# Altium schematic sheet 11 FREELINK.SchDoc
size 817 x 513 mm
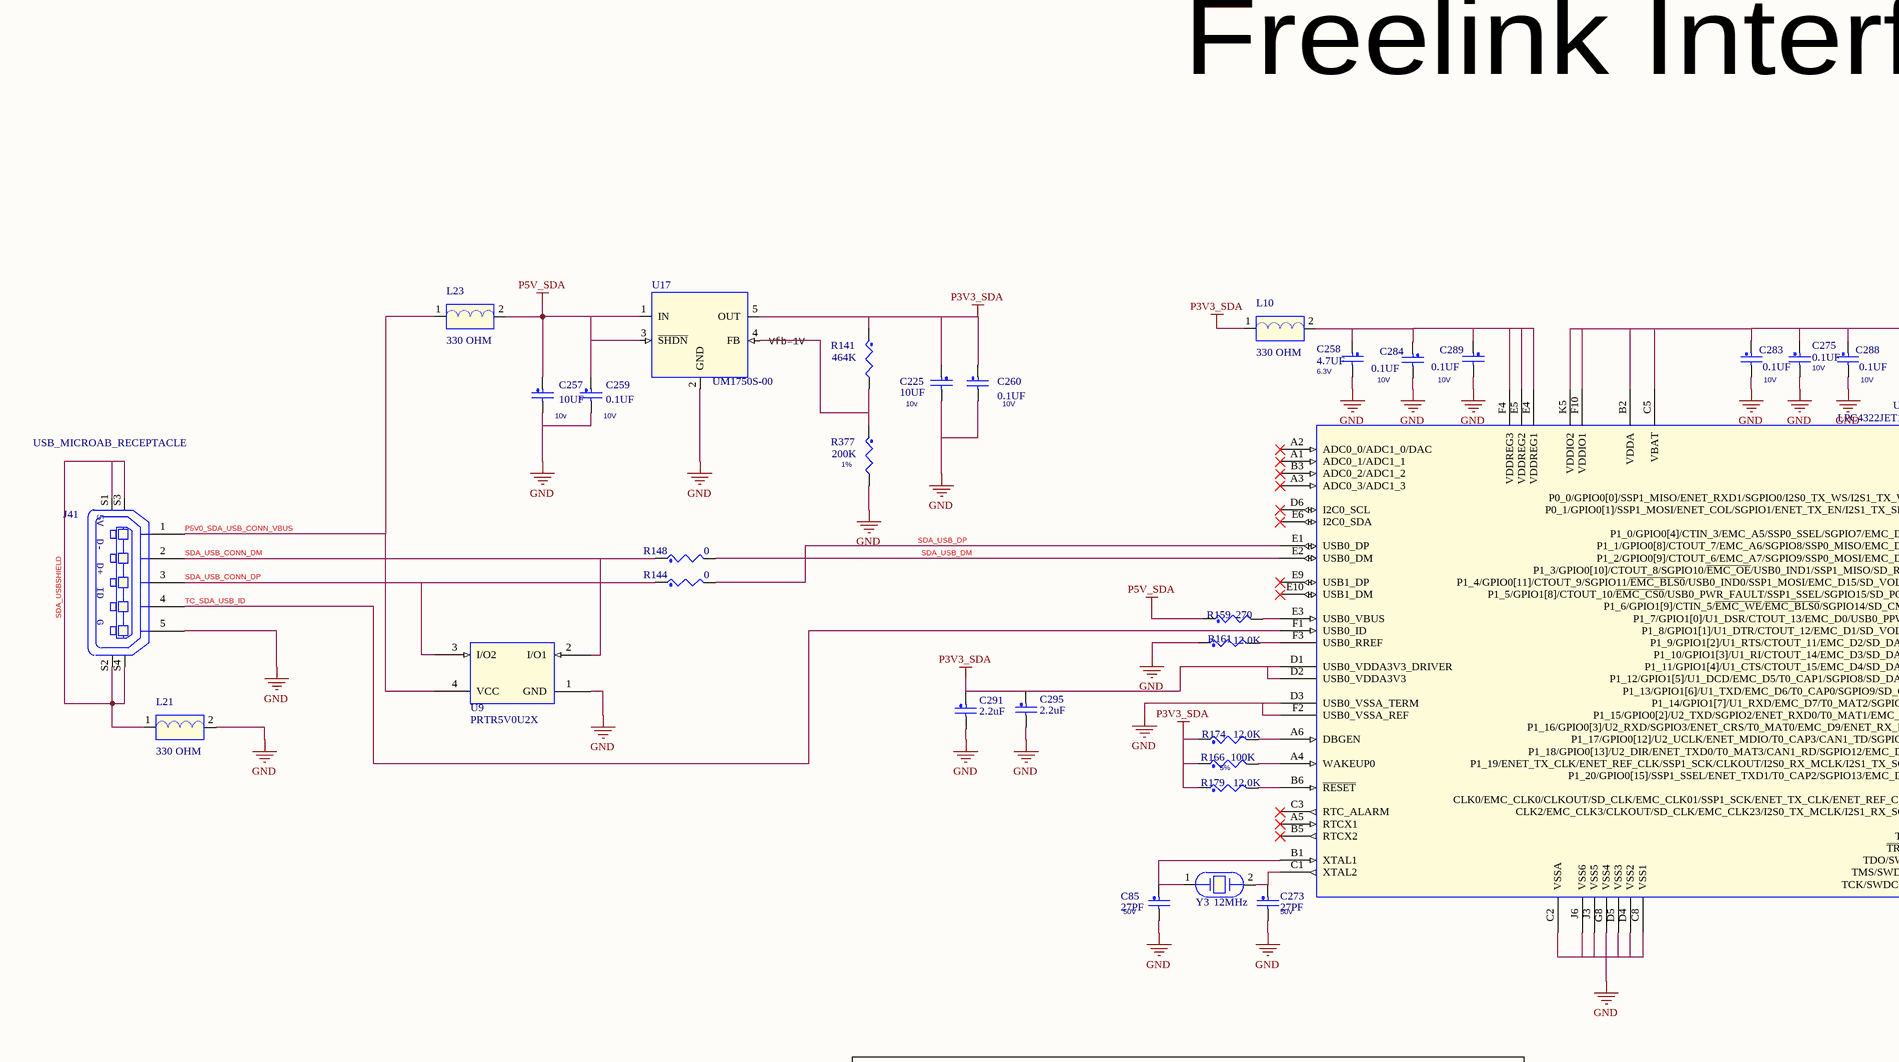
[diagram p0: 11 FREELINK.SchDoc, top left]
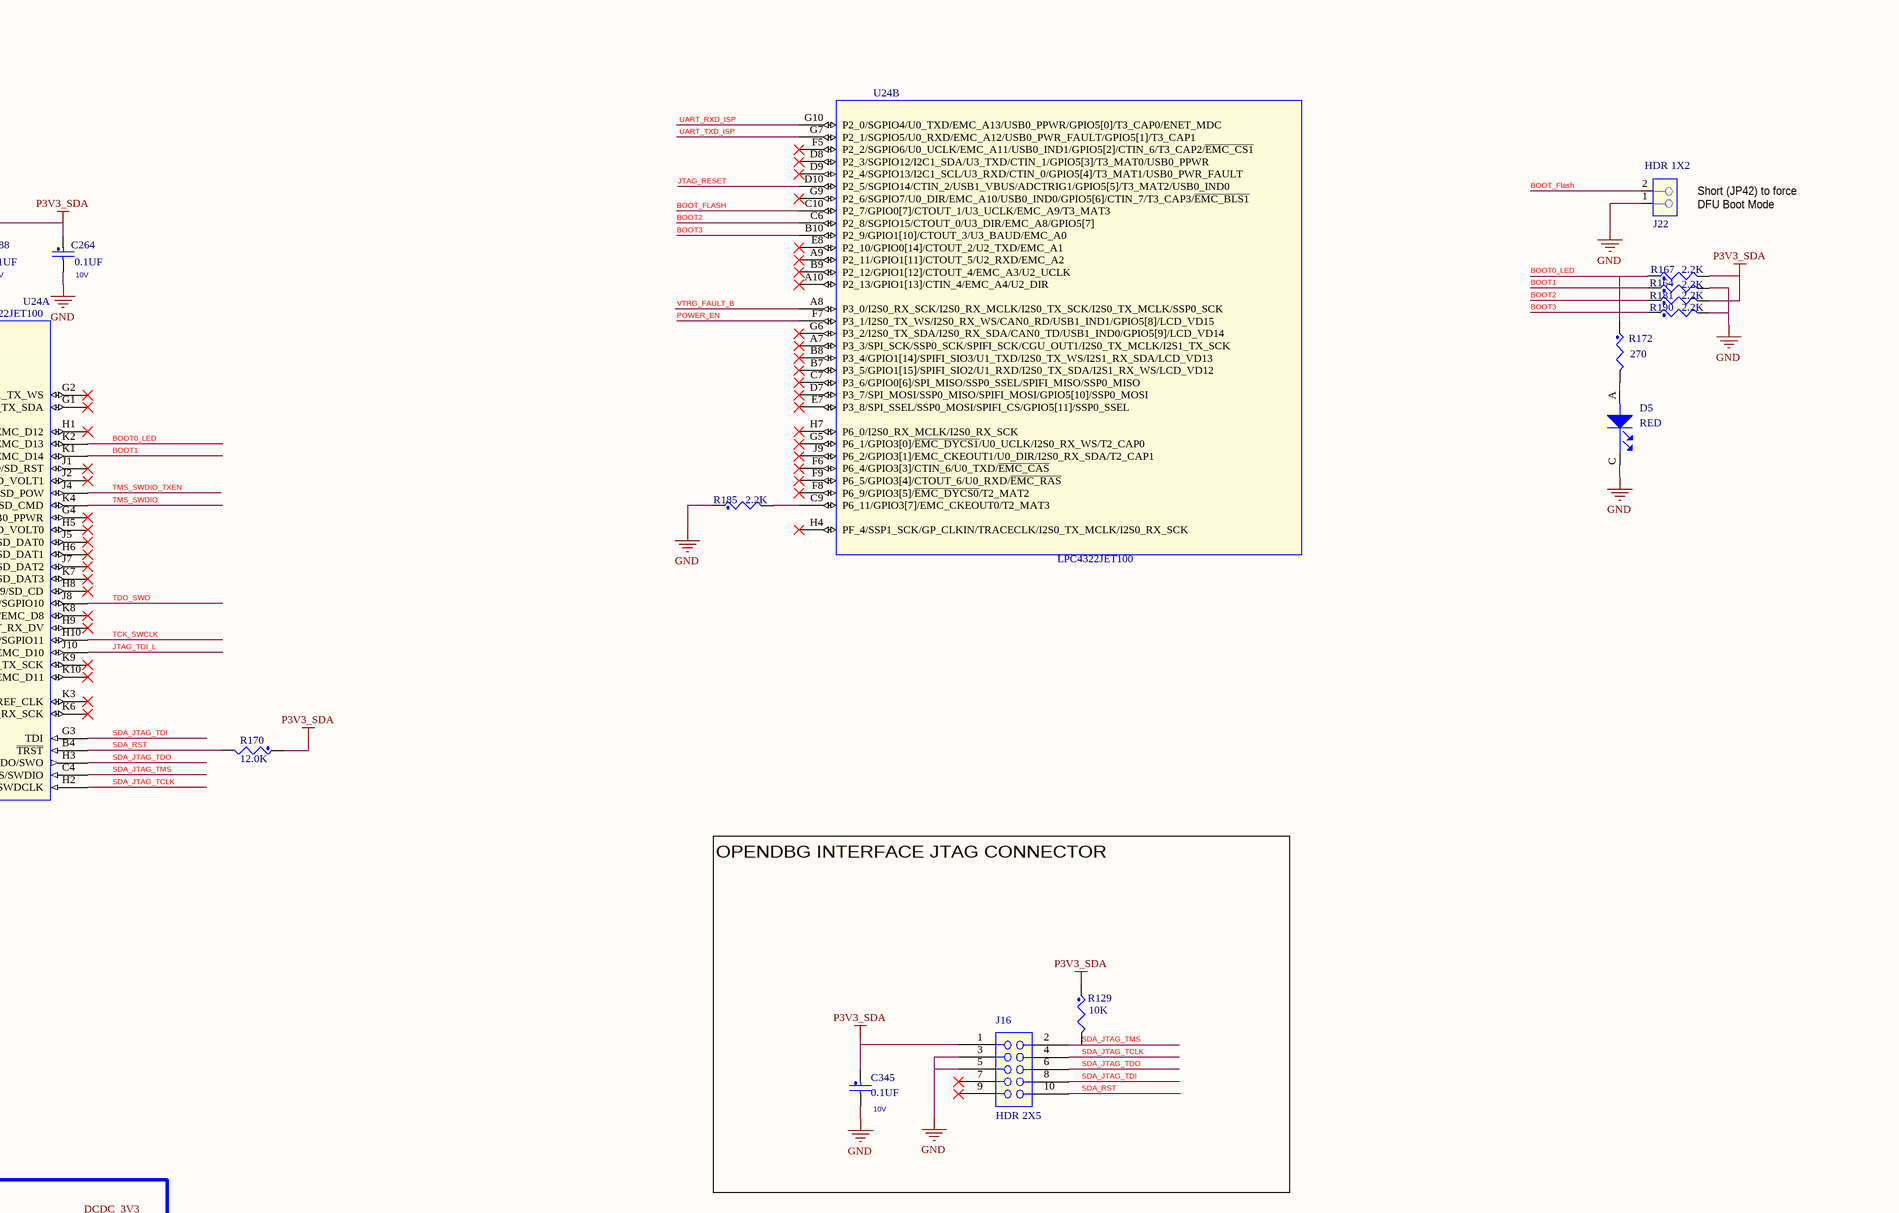
[diagram p1: 11 FREELINK.SchDoc, top right]
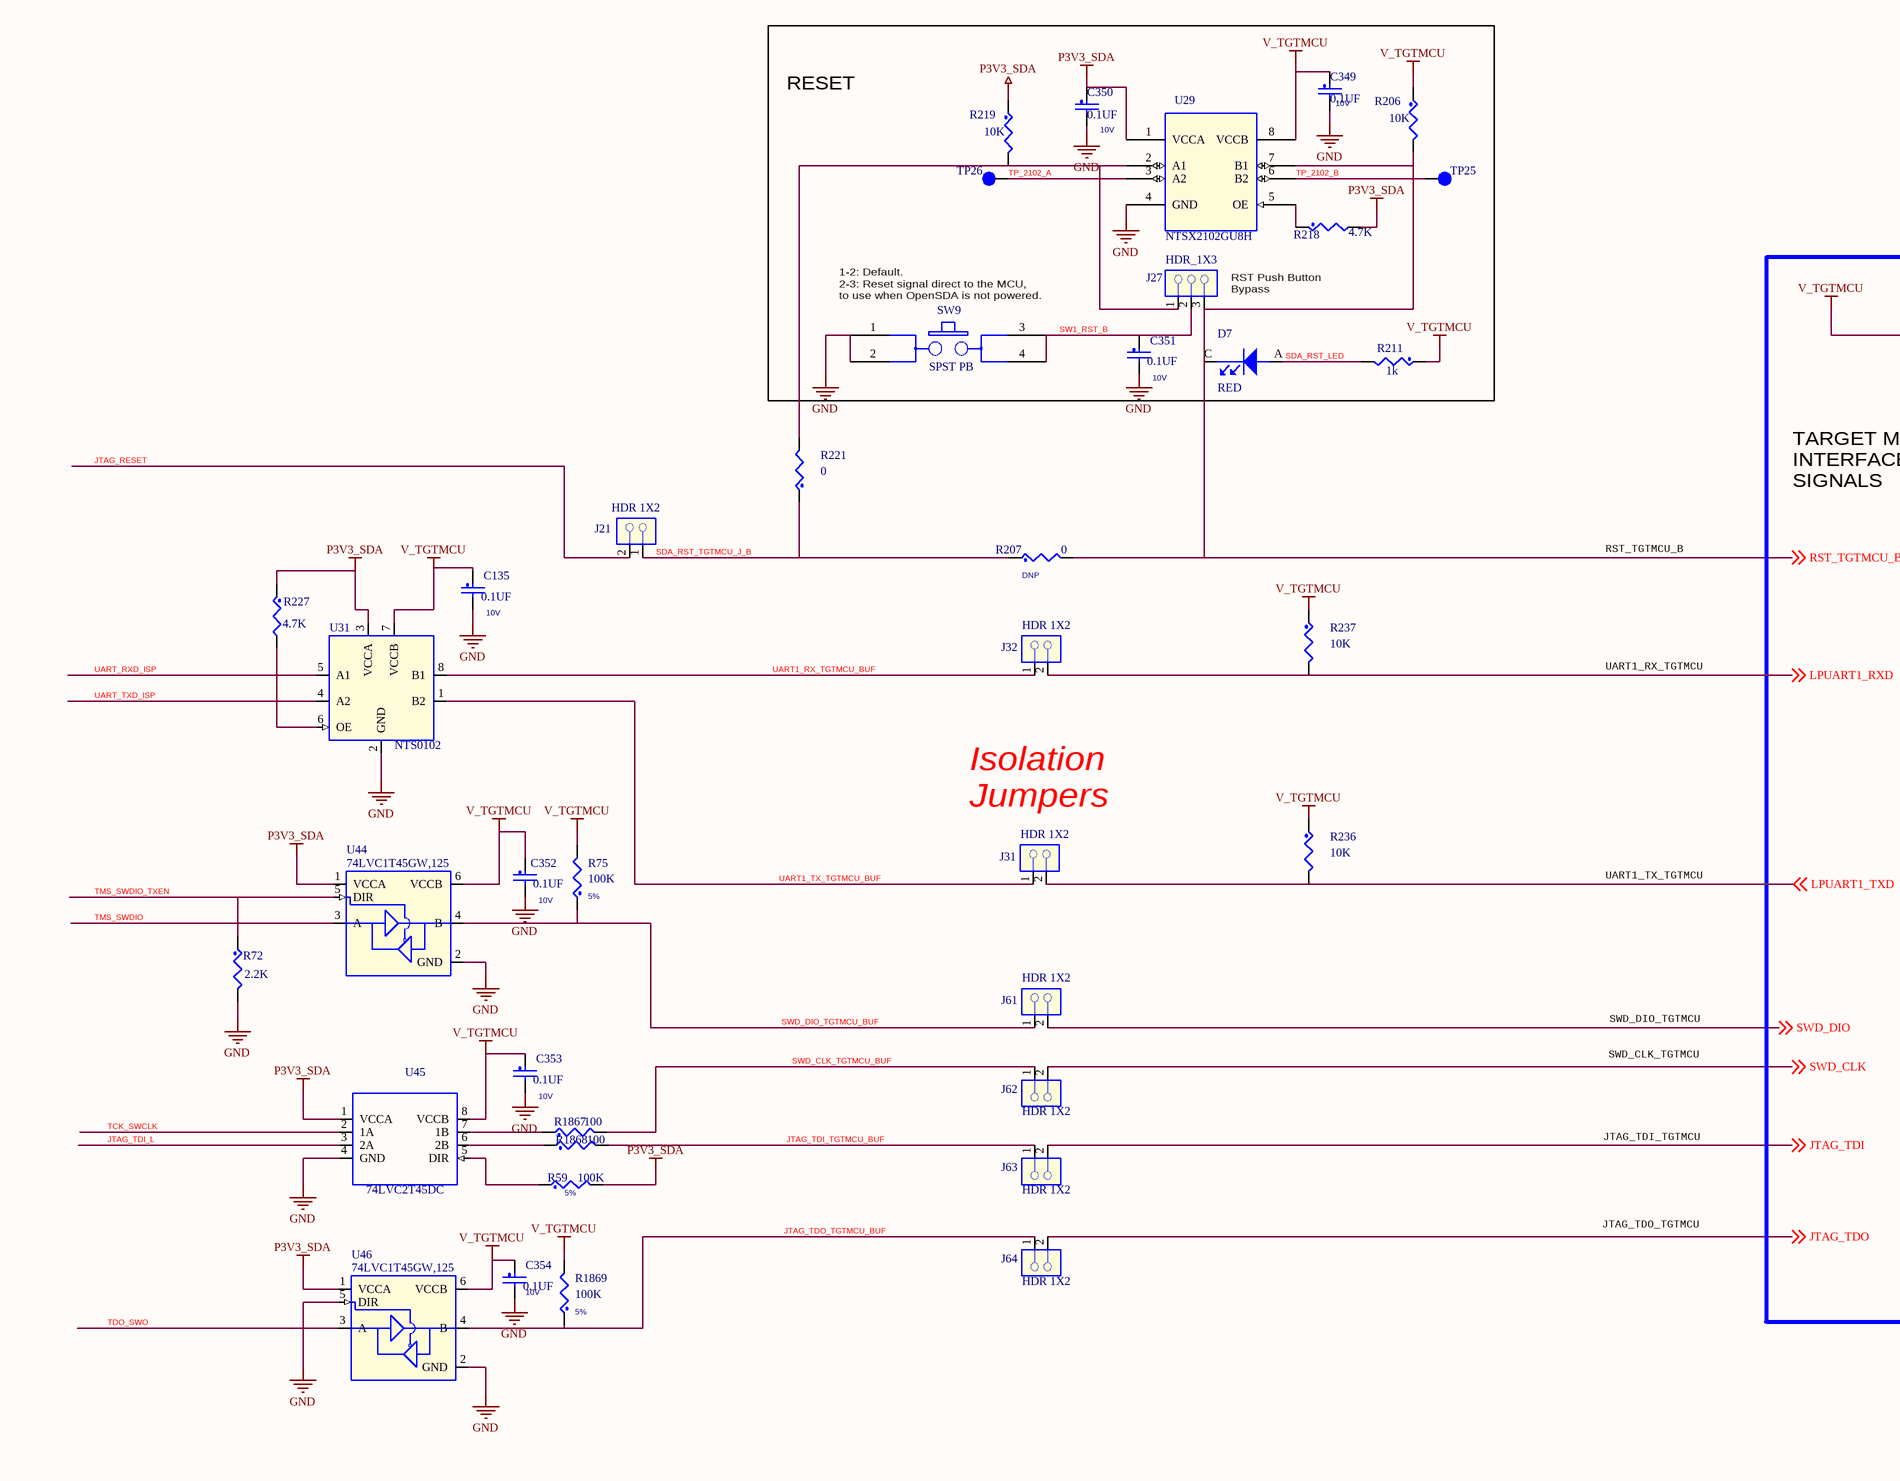
[diagram p2: 11 FREELINK.SchDoc, bottom left]
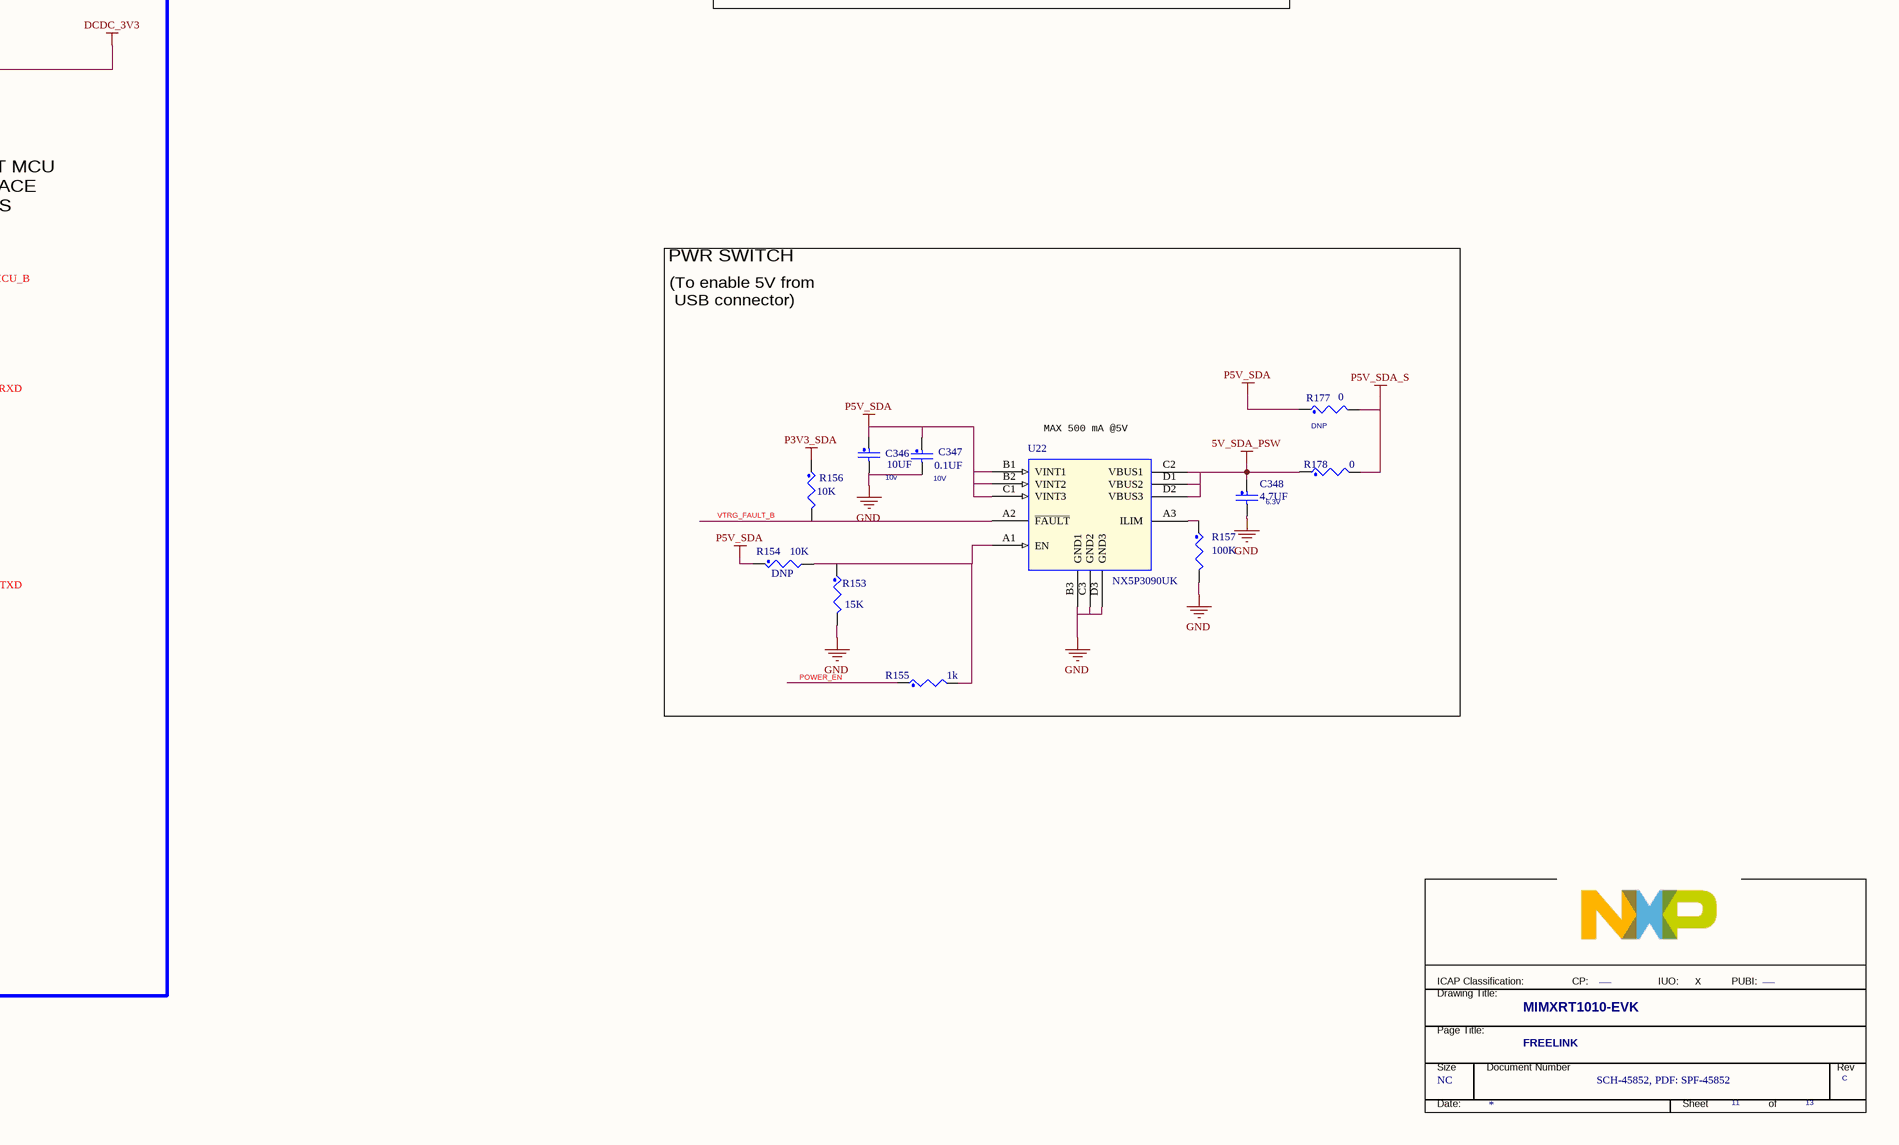
[diagram p3: 11 FREELINK.SchDoc, bottom right]

## Parts
*  PUBI: ___  Doc: SCH-45852, PDF: SPF-45852  RevCode: C  Title: MIMXRT1010-EVK  Page Size: NC  Page Number: 11  Page Count: 13  PageTitle: FREELINK  (hidden comment: TitleBlock_FS)  (graphical)
C85  27PF  VOLTAGE: 50V  [0402_CC]
C135  0.1UF  VOLTAGE: 10V  [0402_CC]
C225  10UF  VOLTAGE: 10v  [CC0603_OV]
C257  10UF  VOLTAGE: 10v  [CC0603_OV]
C258  4.7UF  voltage rating: 6.3V  [0402_CC]
C259  0.1UF  VOLTAGE: 10V  [0402_CC]
C260  0.1UF  VOLTAGE: 10V  [0402_CC]
C264  0.1UF  VOLTAGE: 10V  [0402_CC]
C273  27PF  VOLTAGE: 50V  [0402_CC]
C275  0.1UF  VOLTAGE: 10V  [0402_CC]
C283  0.1UF  VOLTAGE: 10V  [0402_CC]
C284  0.1UF  VOLTAGE: 10V  [0402_CC]
C288  0.1UF  VOLTAGE: 10V  [0402_CC]
C289  0.1UF  VOLTAGE: 10V  [0402_CC]
C291  2.2uF  [0402_CC]
C295  2.2uF  [0402_CC]
C345  0.1UF  VOLTAGE: 10V  [0402_CC]
C346  10UF  VOLTAGE: 10v  [CC0603_OV]
C347  0.1UF  VOLTAGE: 10V  [0402_CC]
C348  4.7UF  VOLTAGE: 6.3V  [0402_CC]
C349  0.1UF  VOLTAGE: 10V  [0402_CC]
C350  0.1UF  VOLTAGE: 10V  [0402_CC]
C351  0.1UF  VOLTAGE: 10V  [0402_CC]
C352  0.1UF  VOLTAGE: 10V  [0402_CC]
C353  0.1UF  VOLTAGE: 10V  [0402_CC]
C354  0.1UF  VOLTAGE: 10V  [0402_CC]
D5  RED  [LED_0603]
D7  RED  [LED_0603]
J16  HDR 2X5  [hdr205_50_th]
J21  HDR 1X2  [HDR102]
J22  HDR 1X2  [HDR102]
J27  HDR_1X3  [HDR103]
J31  HDR 1X2  [HDR102]
J32  HDR 1X2  [HDR102]
J41  USB_MICROAB_RECEPTACLE  [con_usb5_microab_0p65_sm]
J61  HDR 1X2  [HDR102]
J62  HDR 1X2  [HDR102]
J63  HDR 1X2  [HDR102]
J64  HDR 1X2  [HDR102]
L10  330 OHM  [ind_1608]
L21  330 OHM  [ind_1608]
L23  330 OHM  [ind_1608]
R59  100K  Tolerance: 5%  [0402_CC]
R72  2.2K  [0402_CC]
R75  100K  Tolerance: 5%  [0402_CC]
R129  10K  [0402_CC]
R141  464K  [0402_CC]
R144  0  [0402_CC]
R148  0  [0402_CC]
R153  15K  [0402_CC]
R154  10K  ASSY_OPT: DNP  [0402_CC]
R155  1k  [0402_CC]
R156  10K  [0402_CC]
R157  100K  [0402_CC]
R159  270  [0402_CC]
R161  12.0K  [0402_CC]
R164  2.2K  [0402_CC]
R166  100K  Tolerance: 5%  [0402_CC]
R167  2.2K  [0402_CC]
R170  12.0K  [0402_CC]
R172  270  [0402_CC]
R174  12.0K  [0402_CC]
R177  0  ASSY_OPT: DNP  [0402_CC]
R178  0  [0402_CC]
R179  12.0K  [0402_CC]
R181  2.2K  [0402_CC]
R185  2.2K  [0402_CC]
R190  2.2K  [0402_CC]
R206  10K  [0402_CC]
R207  0  ASSY_OPT: DNP  [0402_CC]
R211  1k  [0402_CC]
R218  4.7K  [0402_CC]
R219  10K  [0402_CC]
R221  0  [0402_CC]
R227  4.7K  [0402_CC]
R236  10K  [0402_CC]
R237  10K  [0402_CC]
R377  200K  Tolerance: 1%  [0402_CC]
R1867  100  [0402_CC]
R1868  100  [0402_CC]
R1869  100K  Tolerance: 5%  [0402_CC]
SW9  SPST PB  [SW4_PB_ESW_SM_P177]
TP25  TPAD_030  [TPAD_030]  (value not drawn)
TP26  TPAD_030  [TPAD_030]  (value not drawn)
U9  PRTR5V0U2X  [SOT143B]
U17  UM1750S-00  [sot23-5_a]
U22  NX5P3090UK  [wlcsp12_0p4_1p38x1p68mm_smdp]
U24  LPC4322JET100  [fbga100_0p8_9x9]  (parts A,B of 2)
U29  NTSX2102GU8H  [SO-8]
U31  NTS0102  [tssop8_a]
U44  74LVC1T45GW,125  [SOT-363_0P65_SMT]
U45  74LVC2T45DC  [SSOP8_DCU]
U46  74LVC1T45GW,125  [SOT-363_0P65_SMT]
Y3  12MHz  [xtl2_11p6x4p85_sm]

## Blocks framed on the sheet
OPENDBG INTERFACE JTAG CONNECTOR: C345 J16 R129
RESET: C349-C351 D7 J27 R206 R211 R218 R219 SW9 TP25 TP26 U29
PWR SWITCH: C346-C348 R153-R157 R177 R178 U22

## Nets
5V_SDA_PSW: C348.1 R178.1 U22.C2(VBUS1) U22.D1(VBUS2) U22.D2(VBUS3)
DCDC_3V3: C135.1 C349.1 C352.1 C353.1 C354.1 R75.2 R206.1 R211.1 R236.1 R237.1 R1869.2 U29.8(VCCB) U31.7(VCCB) U44.6(VCCB) U45.8(VCCB) U46.6(VCCB)  [also labelled V_TGTMCU]
GND: C85.2 C135.2 C225.2 C257.2 C258.2 C259.2 C260.2 C264.2 C273.2 C275.2 C283.2 C284.2 C288.2 C289.2 C291.2 C295.2 C345.2 C346.2 C347.2 C348.2 C349.2 C350.2 C351.2 C352.2 C353.2 C354.2 D5.C(CATHODE) J16.3(A2) J16.5(A3) J22.1 J41.5(P5) L21.2 R72.2 R153.2 R157.2 R161.1 R164.2 R185.1 R190.2 R377.2 SW9.1(A1) SW9.2(A2) U9.1(GND) U17.2(GND) U22.B3(GND1) U22.C3(GND2) U22.D3(GND3) U24.C2(VSSA) U24.C8(VSS1) U24.D3(USB0_VSSA_TERM) U24.D4(VSS2) U24.D5(VSS3) U24.F2(USB0_VSSA_REF) U24.G8(VSS4) U24.J3(VSS5) U24.J6(VSS6) U29.4(GND) U31.2(GND) U44.2(GND) U45.4(GND) U46.2(GND) U46.5(DIR)
P3V3_SDA: C225.1 C260.1 C264.1 C275.1 C283.1 C288.1 C291.1 C295.1 C345.1 C350.1 J16.1(A1) L10.1 R59.2 R129.1 R141.1 R156.1 R166.1 R167.2 R170.1 R174.1 R179.1 R181.2 R218.2 R219.1 R227.1 U17.5(OUT) U24.B2(VDDA) U24.C5(VBAT) U24.D1(USB0_VDDA3V3_DRIVER) U24.D2(USB0_VDDA3V3) U24.F10(VDDIO1) U24.K5(VDDIO2) U29.1(VCCA) U31.3(VCCA) U44.1(VCCA) U45.1(VCCA) U46.1(VCCA)
P5V_SDA: C257.1 C259.1 C346.1 C347.1 L23.2 R154.1 R159.1 R177.1 U17.1(IN) U17.3(~{SHDN}) U22.B1(VINT1) U22.B2(VINT2) U22.C1(VINT3)
P5V_SDA_S: R177.2 R178.2
BOOT0_LED: R167.1 R172.1 U24.K2(P1_1/GPIO0[8]/CTOUT_7/EMC_A6/SGPIO8/SSP0_MISO/EMC_D13)
BOOT1: R164.1 U24.K1(P1_2/GPIO0[9]/CTOUT_6/EMC_A7/SGPIO9/SSP0_MOSI/EMC_D14)
BOOT2: R181.1 U24.C6(P2_8/SGPIO15/CTOUT_0/U3_DIR/EMC_A8/GPIO5[7])
BOOT3: R190.1 U24.B10(P2_9/GPIO1[10]/CTOUT_3/U3_BAUD/EMC_A0)
BOOT_Flash: J22.2 U24.C10(P2_7/GPIO0[7]/CTOUT_1/U3_UCLK/EMC_A9/T3_MAT3)
JTAG_RESET: J21.2 U24.D10(P2_5/SGPIO14/CTIN_2/USB1_VBUS/ADCTRIG1/GPIO5[5]/T3_MAT2/USB0_IND0)
JTAG_TDI: J63.2 ; off-sheet JTAG_TDI
JTAG_TDI_L: U24.J10(P1_18/GPIO0[13]/U2_DIR/ENET_TXD0/T0_MAT3/CAN1_RD/SGPIO12/EMC_D10) U45.3(2A)
JTAG_TDI_TGTMCU_BUF: J63.1 R1868.2
JTAG_TDO: J64.2 ; off-sheet JTAG_TDO
JTAG_TDO_TGTMCU_BUF: J64.1 R1869.1 U46.4(B)
LPUART1_RXD: J32.2 R237.2 ; off-sheet LPUART1_RXD
LPUART1_TXD: J31.2 R236.2 ; off-sheet LPUART1_TXD
P5V0_SDA_USB_CONN_VBUS: J41.1(P1) L23.1 U9.4(VCC)
POWER_EN: R155.1 U24.F7(P3_1/I2S0_TX_WS/I2S0_RX_WS/CAN0_RD/USB1_IND1/GPIO5[8]/LCD_VD15)
RST_TGTMCU_B: D7.C(CATHODE) J27.3 R206.2 R207.2 U29.7(B1) ; off-sheet RST_TGTMCU_B
SDA_JTAG_TCLK: J16.4(B2) U24.H2(TCK/SWDCLK)
SDA_JTAG_TDI: J16.8(B4) U24.G3(TDI)
SDA_JTAG_TDO: J16.6(B3) U24.H3(TDO/SWO)
SDA_JTAG_TMS: J16.2(B1) R129.2 U24.C4(TMS/SWDIO)
SDA_RST: J16.10(B5) R170.2 U24.B4(~{TRST})
SDA_RST_LED: D7.A(ANODE) R211.2
SDA_RST_TGTMCU_J_B: J21.1 R207.1 R221.1
SDA_USB_CONN_DM: J41.2(P2) R148.1 U9.2(I/O1)
SDA_USB_CONN_DP: J41.3(P3) R144.1 U9.3(I/O2)
SDA_USB_DM: R148.2 U24.E2(USB0_DM)
SDA_USB_DP: R144.2 U24.E1(USB0_DP)
SDA_USBSHIELD: J41.S1(SHLD1) J41.S2(SHLD2) J41.S3(SHLD3) J41.S4(SHLD4) L21.1
SW1_RST_B: C351.1 J27.2 SW9.3(B1) SW9.4(B2)
SWD_CLK: J62.2 ; off-sheet SWD_CLK
SWD_CLK_TGTMCU_BUF: J62.1 R1867.2
SWD_DIO: J61.2 ; off-sheet SWD_DIO
SWD_DIO_TGTMCU_BUF: J61.1 R75.1 U44.4(B)
TC_SDA_USB_ID: J41.4(P4) U24.F1(USB0_ID)
TCK_SWCLK: U24.H10(P1_17/GPIO0[12]/U2_UCLK/ENET_MDIO/T0_CAP3/CAN1_TD/SGPIO11) U45.2(1A)
TDO_SWO: U24.J8(P1_14/GPIO1[7]/U1_RXD/EMC_D7/T0_MAT2/SGPIO10) U46.3(A)
TMS_SWDIO: U24.K4(P1_6/GPIO1[9]/CTIN_5/~{EMC_WE}/~{EMC_BLS0}/SGPIO14/SD_CMD) U44.3(A)
TMS_SWDIO_TXEN: R72.1 U24.J4(P1_5/GPIO1[8]/CTOUT_10/~{EMC_CS0}/USB0_PWR_FAULT/SSP1_SSEL/SGPIO15/SD_POW) U44.5(DIR)
TP_2102_A: TP26.1(Pin1) U29.3(A2)
TP_2102_B: TP25.1(Pin1) U29.6(B2)
UART1_RX_TGTMCU_BUF: J32.1 U31.8(B1)
UART1_TX_TGTMCU_BUF: J31.1 U31.1(B2)
UART_RXD_ISP: U24.G10(P2_0/SGPIO4/U0_TXD/EMC_A13/USB0_PPWR/GPIO5[0]/T3_CAP0/ENET_MDC) U31.5(A1)
UART_TXD_ISP: U24.G7(P2_1/SGPIO5/U0_RXD/EMC_A12/USB0_PWR_FAULT/GPIO5[1]/T3_CAP1) U31.4(A2)
VTRG_FAULT_B: R156.2 U22.A2(~{FAULT}) U24.A8(P3_0/I2S0_RX_SCK/I2S0_RX_MCLK/I2S0_TX_SCK/I2S0_TX_MCLK/SSP0_SCK)
NetC85_1: C85.1 U24.B1(XTAL1) Y3.1
NetC258_1: C258.1 C284.1 C289.1 L10.2 U24.E4(VDDREG1) U24.E5(VDDREG2) U24.F4(VDDREG3)
NetC273_1: C273.1 U24.C1(XTAL2) Y3.2
NetD5_A: D5.A(ANODE) R172.2
NetJ27_1: J27.1 R219.2 R221.2 U29.2(A1)
NetR59_1: R59.1 U45.5(DIR)
NetR141_2: R141.2 R377.1 U17.4(FB)
NetR153_1: R153.1 R154.2 R155.2 U22.A1(EN)
NetR157_1: R157.1 U22.A3(ILIM)
NetR159_2: R159.2 U24.E3(USB0_VBUS)
NetR161_2: R161.2 U24.F3(USB0_RREF)
NetR166_2: R166.2 U24.A4(WAKEUP0)
NetR174_2: R174.2 U24.A6(DBGEN)
NetR179_2: R179.2 U24.B6(~{RESET})
NetR185_2: R185.2 U24.C9(P6_11/GPIO3[7]/EMC_CKEOUT0/T2_MAT3)
NetR218_1: R218.1 U29.5(OE)
NetR227_2: R227.2 U31.6(OE)
NetR1867_1: R1867.1 U45.7(1B)
NetR1868_1: R1868.1 U45.6(2B)

Not connected (* = marked no-connect by the designer): J16 7(A4)* 9(A5)*; U24 A1(ADC0_1/ADC1_1)* A2(ADC0_0/ADC1_0/DAC)* A3(ADC0_3/ADC1_3)* A5(RTCX1)* A7(P3_3/SPI_SCK/SSP0_SCK/SPIFI_SCK/CGU_OUT1/I2S0_TX_MCLK/I2S1_TX_SCK)* A9(P2_11/GPIO1[11]/CTOUT_5/U2_RXD/EMC_A2)* A10(P2_13/GPIO1[13]/CTIN_4/EMC_A4/U2_DIR)* B3(ADC0_2/ADC1_2)* B5(RTCX2)* B7(P3_5/GPIO1[15]/SPIFI_SIO2/U1_RXD/I2S0_TX_SDA/I2S1_RX_WS/LCD_VD12)* B8(P3_4/GPIO1[14]/SPIFI_SIO3/U1_TXD/I2S0_TX_WS/I2S1_RX_SDA/LCD_VD13)* B9(P2_12/GPIO1[12]/CTOUT_4/EMC_A3/U2_UCLK)* C3(RTC_ALARM)* C7(P3_6/GPIO0[6]/SPI_MISO/SSP0_SSEL/SPIFI_MISO/SSP0_MISO)* D6(I2C0_SCL)* D7(P3_7/SPI_MOSI/SSP0_MISO/SPIFI_MOSI/GPIO5[10]/SSP0_MOSI)* D8(P2_3/SGPIO12/I2C1_SDA/U3_TXD/CTIN_1/GPIO5[3]/T3_MAT0/USB0_PPWR)* D9(P2_4/SGPIO13/I2C1_SCL/U3_RXD/CTIN_0/GPIO5[4]/T3_MAT1/USB0_PWR_FAULT)* E6(I2C0_SDA)* E7(P3_8/SPI_SSEL/SSP0_MOSI/SPIFI_CS/GPIO5[11]/SSP0_SSEL)* E8(P2_10/GPIO0[14]/CTOUT_2/U2_TXD/EMC_A1)* E9(USB1_DP)* E10(USB1_DM)* F5(P2_2/SGPIO6/U0_UCLK/EMC_A11/USB0_IND1/GPIO5[2]/CTIN_6/T3_CAP2/~{EMC_CS1})* F6(P6_4/GPIO3[3]/CTIN_6/U0_TXD/~{EMC_CAS})* F8(P6_9/GPIO3[5]/~{EMC_DYCS0}/T2_MAT2)* F9(P6_5/GPIO3[4]/CTOUT_6/U0_RXD/~{EMC_RAS})* G1(P0_1/GPIO0[1]/SSP1_MOSI/ENET_COL/SGPIO1/ENET_TX_EN/I2S1_TX_SDA)* G2(P0_0/GPIO0[0]/SSP1_MISO/ENET_RXD1/SGPIO0/I2S0_TX_WS/I2S1_TX_WS)* G4(P1_7/GPIO1[0]/U1_DSR/CTOUT_13/EMC_D0/USB0_PPWR)* G5(P6_1/GPIO3[0]/~{EMC_DYCS1}/U0_UCLK/I2S0_RX_WS/T2_CAP0)* G6(P3_2/I2S0_TX_SDA/I2S0_RX_SDA/CAN0_TD/USB1_IND0/GPIO5[9]/LCD_VD14)* G9(P2_6/SGPIO7/U0_DIR/EMC_A10/USB0_IND0/GPIO5[6]/CTIN_7/T3_CAP3/~{EMC_BLS1})* H1(P1_0/GPIO0[4]/CTIN_3/EMC_A5/SSP0_SSEL/SGPIO7/EMC_D12)* H4(PF_4/SSP1_SCK/GP_CLKIN/TRACECLK/I2S0_TX_MCLK/I2S0_RX_SCK)* H5(P1_8/GPIO1[1]/U1_DTR/CTOUT_12/EMC_D1/SD_VOLT0)* H6(P1_10/GPIO1[3]/U1_RI/CTOUT_14/EMC_D3/SD_DAT1)* H7(P6_0/I2S0_RX_MCLK/I2S0_RX_SCK)* H8(P1_13/GPIO1[6]/U1_TXD/EMC_D6/T0_CAP0/SGPIO9/SD_CD)* H9(P1_16/GPIO0[3]/U2_RXD/SGPIO3/ENET_CRS/T0_MAT0/EMC_D9/ENET_RX_DV)* J1(P1_3/GPIO0[10]/CTOUT_8/SGPIO10/~{EMC_OE}/USB0_IND1/SSP1_MISO/SD_RST)* J2(P1_4/GPIO0[11]/CTOUT_9/SGPIO11/~{EMC_BLS0}/USB0_IND0/SSP1_MOSI/EMC_D15/SD_VOLT1)* J5(P1_9/GPIO1[2]/U1_RTS/CTOUT_11/EMC_D2/SD_DAT0)* J7(P1_11/GPIO1[4]/U1_CTS/CTOUT_15/EMC_D4/SD_DAT2)* J9(P6_2/GPIO3[1]/EMC_CKEOUT1/U0_DIR/I2S0_RX_SDA/T2_CAP1)* K3(CLK0/EMC_CLK0/CLKOUT/SD_CLK/EMC_CLK01/SSP1_SCK/ENET_TX_CLK/ENET_REF_CLK)* K6(CLK2/EMC_CLK3/CLKOUT/SD_CLK/EMC_CLK23/I2S0_TX_MCLK/I2S1_RX_SCK)* K7(P1_12/GPIO1[5]/U1_DCD/EMC_D5/T0_CAP1/SGPIO8/SD_DAT3)* K8(P1_15/GPIO0[2]/U2_TXD/SGPIO2/ENET_RXD0/T0_MAT1/EMC_D8)* K9(P1_19/ENET_TX_CLK/ENET_REF_CLK/SSP1_SCK/CLKOUT/I2S0_RX_MCLK/I2S1_TX_SCK)* K10(P1_20/GPIO0[15]/SSP1_SSEL/ENET_TXD1/T0_CAP2/SGPIO13/EMC_D11)*

## Notes on the sheet
- Freelink Interface
- Short (JP42) to force
  DFU Boot Mode
- (near U17) Vfb=1V
- (near SW9) 1-2: Default.
  2-3: Reset signal direct to the MCU,
  to use when OpenSDA is not powered.
- RST Push Button
  Bypass
- TARGET MCU
  INTERFACE
  SIGNALS
- RST_TGTMCU_B
- (To enable 5V from
  USB connector)
- UART1_RX_TGTMCU
- Isolation
  Jumpers
- (near U22) MAX 500 mA @5V
- UART1_TX_TGTMCU
- SWD_DIO_TGTMCU
- SWD_CLK_TGTMCU
- JTAG_TDI_TGTMCU
- JTAG_TDO_TGTMCU
- X
- (in symbol TitleBlock_FS) ICAP Classification:; CP:; IUO:; PUBI:; Drawing Title:; Page Title:; Size; Document Number; Rev; Date:; Sheet; of
- (in symbol USB_MINI_AB_RECEPTACLE) 5V; D-; D+; ID; G

## Library data of the parts
* = TitleBlock_FS: FIUO: _X_; OrgAddr2: Austin, TX 78735-8598; OrgAddr1: 6501 William Cannon Drive West; OrgName: Freescale Semiconductor; FCP: ___; Page Create Date: March  8, 1995; Page Modify Date: *
C85 = CAP_NP: CAP CER 27PF 50V 5% C0G 0402; CLASS: DISCRETE; FPLIST: CC0402_25,CC0402_HD,0402_CC; CAD_APPROVED: Yes; MFG_PN01: C0402C270J5GAC; MFG_NAME01: KEMET; AGILE_PN: 150-30109; HEIGHT: .55mm; ROHS: Yes; Tolerance: 5%; PCB Footprint: 0402_CC
C135 C283 C284 C345 C352-C354 = CAP_NP: CAP CER 0.1UF 10V 10% X5R 0402; CLASS: DISCRETE; AGILE_PN: 150-75634; MFG_NAME01: YAGEO AMERICA; MFG_PN01: CC0402KRX5R6BB104; CAD_APPROVED: Yes; FPLIST: CC0402_25,CC0402_HD,0402_CC; Tolerance: 10%; ROHS: Yes; HEIGHT: 0.64MM; PCB Footprint: 0402_CC
C225 C346 = CAP_NP: CAP CER 10UF 10V 10% X5R 0603; CLASS: DISCRETE; FPLIST: CC0603_OV,CC0603,0603_CC; CAD_APPROVED: Yes; Temp_Range: -55¡ãC ~ 85¡ãC; MFG_PN01: GRM188R61A106KE69D; MFG_NAME01: MURATA; AGILE_PN: 150-78675; HEIGHT: 1.016MM; ROHS: Yes; Tolerance: 10%; PCB Footprint: CC0603_OV
C257 = CAP_NP: CAP CER 10UF 10V 10% X5R 0603; CLASS: DISCRETE; AGILE_PN: 150-78675; MFG_NAME01: MURATA; MFG_PN01: GRM188R61A106KE69D; Temp_Range: -55¡ãC ~ 85¡ãC; CAD_APPROVED: Yes; FPLIST: CC0603_OV,CC0603,0603_CC; Tolerance: 10%; ROHS: Yes; HEIGHT: 1.016MM; PCB Footprint: CC0603_OV
C258 C348 = CAP_NP: CAP CER 4.7UF 6.3V 20% X5R 0402; CLASS: DISCRETE; AGILE_PN: 150-78463; MFG_NAME01: TDK; MFG_PN01: C1005X5R0J475M050BC; CAD_APPROVED: Yes; FPLIST: CC0402_25,CC0402_HD,0402_CC; Tolerance: 20%; ROHS: Yes; HEIGHT: 0.65MM; PCB Footprint: 0402_CC
  C258: VOLTAGE: 6.3V
  C348: TOL: 20%
C259 C260 C264 C275 C288 C289 C347 C349-C351 = CAP_NP: CAP CER 0.1UF 10V 10% X5R 0402; CLASS: DISCRETE; FPLIST: CC0402_25,CC0402_HD,0402_CC; CAD_APPROVED: Yes; MFG_PN01: CC0402KRX5R6BB104; MFG_NAME01: YAGEO AMERICA; AGILE_PN: 150-75634; HEIGHT: 0.64MM; ROHS: Yes; Tolerance: 10%; PCB Footprint: 0402_CC
C273 = CAP_NP: CAP CER 27PF 50V 5% C0G 0402; CLASS: DISCRETE; AGILE_PN: 150-30109; MFG_NAME01: KEMET; MFG_PN01: C0402C270J5GAC; CAD_APPROVED: Yes; FPLIST: CC0402_25,CC0402_HD,0402_CC; Tolerance: 5%; ROHS: Yes; HEIGHT: .55mm; PCB Footprint: 0402_CC
C291 = CAP_NP: CAP CER 2.2uF 6.3V 10% X5R 0402; CLASS: DISCRETE; FPLIST: CC0402_25,CC0402_HD,0402_CC; CAD_APPROVED: Yes; MFG_PN01: GRM155R60J225KE01D; MFG_NAME01: MURATA; AGILE_PN: 150-79454; VOLTAGE: 6.3V; HEIGHT: 0.55MM; ROHS: Yes; Tolerance: 10%; PCB Footprint: 0402_CC
C295 = CAP_NP: CAP CER 2.2uF 6.3V 10% X5R 0402; CLASS: DISCRETE; AGILE_PN: 150-79454; MFG_NAME01: MURATA; MFG_PN01: GRM155R60J225KE01D; CAD_APPROVED: Yes; FPLIST: CC0402_25,CC0402_HD,0402_CC; Tolerance: 10%; ROHS: Yes; HEIGHT: 0.55MM; VOLTAGE: 6.3V; PCB Footprint: 0402_CC
D5 D7 = LED: LED ULTRA BRIGHT RED SGL 30MA 0603; CLASS: IC; AGILE_PN: 370-75079; MFG_NAME01: LITE ON; MFG_PN01: LTST-C190KRKT; CAD_APPROVED: Yes; Temp_Range: -30¡ã C to + 85¡ã C; ROHS: Yes; HEIGHT: 0.9MM; PCB Footprint: LED_0603
J16 = CONN_HDR_5X2: HDR 2X5 TH 50MIL CTR 172H AU 91L; CLASS: IO; AGILE_PN: 210-81466; MFG_NAME01: ANYTRONIC CORPORATION LIMITED; MFG_PN01: 0922S0205011N9T-31RF; Temp_Range: -55DegC to +105DegC; CAD_APPROVED: Yes; ROHS: Yes; HEIGHT: 4.38MM; PCB Footprint: hdr205_50_th
J21 J32 J61 = CONN_HDR_2X1: HDR 1X2 TH 100MIL SP 339H AU 98L; CLASS: IO; AGILE_PN: 210-81490; MFG_NAME01: ANYTRONIC CORPORATION LIMITED; MFG_PN01: 0901S0202011N9T-31RF; Temp_Range: -55¡ãC to +105¡ãC; CAD_APPROVED: Yes; ROHS: Yes; HEIGHT: 8.59MM; PCB Footprint: HDR102
J22 J31 J62-J64 = CONN_HDR_2X1: HDR 1X2 TH 100MIL SP 339H AU 98L; CLASS: IO; CAD_APPROVED: Yes; Temp_Range: -55¡ãC to +105¡ãC; MFG_PN01: 0901S0202011N9T-31RF; MFG_NAME01: ANYTRONIC CORPORATION LIMITED; AGILE_PN: 210-81490; HEIGHT: 8.59MM; ROHS: Yes; PCB Footprint: HDR102
J27 = CONN_HDR_3X1: HDR 1X3 TH 100MIL SP 338H AU 98L; CLASS: IO; AGILE_PN: 210-81491; MFG_NAME01: ANYTRONIC CORPORATION LIMITED; MFG_PN01: 0901S0203011N9T-31RF; Temp_Range: -55¡ãC to +105¡ãC; CAD_APPROVED: Yes; ROHS: Yes; HEIGHT: 8.59MM; PCB Footprint: HDR103
J41 = USB_MINI_AB_RECEPTACLE: CON 5 USB MICRO_AB RA SKT SMT 0.65MM SP 110H AU; CLASS: IO; AGILE_PN: 211-80104; MFG_NAME01: ANYTRONIC CORPORATION LIMITED; MFG_PN01: 23971101#LCP-58RF; Temp_Range: -55&#8451; to 105&#8451;; CAD_APPROVED: Yes; ROHS: Yes; HEIGHT: 2.8MM; PCB Footprint: con_usb5_microab_0p65_sm
L10 = BEAD: IND FER BEAD 330OHM@100MHZ 1.7A 0603; PART_TYPE: FERRITE\BEAD; CLASS: DISCRETE; FPLIST: ind_1608,0603_CC; CAD_APPROVED: Yes; MFG_PN01: MPZ1608S331A; MFG_NAME01: TDK; Tolerance: 25%; AGILE_PN: 180-78156; HEIGHT: 0.95MM; ROHS: Yes; PCB Footprint: ind_1608
L21 L23 = BEAD: IND FER BEAD 330OHM@100MHZ 1.7A 0603; PART_TYPE: FERRITE\BEAD; CLASS: DISCRETE; AGILE_PN: 180-78156; Tolerance: 25%; MFG_NAME01: TDK; MFG_PN01: MPZ1608S331A; CAD_APPROVED: Yes; FPLIST: ind_1608,0603_CC; ROHS: Yes; HEIGHT: 0.95MM; PCB Footprint: ind_1608
R59 = RES_Dup1: RES MF 100K 1/16W 5% 0402; CLASS: DISCRETE; FPLIST: RC0402_25,RC0402_HD,0402_CC; CAD_APPROVED: Yes; MFG_PN01: CR0402-16W-104JT; MFG_NAME01: VENKEL COMPANY; AGILE_PN: 470-75597; Temp_Range: -55C to +155C; HEIGHT: 0.40 MM; TOL: 5%; ROHS: Yes; PCB Footprint: 0402_CC
R72 R167 R185 = RES_Dup1: RES MF 2.2K 1/16W 5% 0402; CLASS: DISCRETE; AGILE_PN: 470-76602; MFG_NAME01: YAGEO AMERICA; MFG_PN01: RC0402JR-072K2L; CAD_APPROVED: Yes; FPLIST: RC0402_25,RC0402_HD,0402_CC; HEIGHT: 0.4 MM; Tolerance: 5%; ROHS: Yes; TOL: 5%; PCB Footprint: 0402_CC
R75 R1869 = RES_Dup1: RES MF 100K 1/16W 5% 0402; CLASS: DISCRETE; AGILE_PN: 470-75597; MFG_NAME01: VENKEL COMPANY; MFG_PN01: CR0402-16W-104JT; CAD_APPROVED: Yes; FPLIST: RC0402_25,RC0402_HD,0402_CC; Temp_Range: -55C to +155C; ROHS: Yes; TOL: 5%; HEIGHT: 0.40 MM; PCB Footprint: 0402_CC
R129 R154 R206 R219 R236 = RES_Dup1: RES MF 10K 1/16W 5% 0402; CLASS: DISCRETE; FPLIST: RC0402_25,RC0402_HD,0402_CC; CAD_APPROVED: Yes; MFG_PN01: CRCW040210K0JNED; MFG_NAME01: VISHAY INTERTECHNOLOGY; AGILE_PN: 470-75557; ROHS: Yes; Tolerance: 5%; HEIGHT: 0.4 MM; PCB Footprint: 0402_CC
  R129 R206 R219: TOL: 5%
R141 = RES_Dup1: RES MF 464K 1/10W 1% AEC-Q200 0402; CLASS: DISCRETE; Temp_Range: -55C to +155C; AGILE_PN: 470-31135; MFG_NAME01: KOA SPEER; MFG_PN01: RK73H1ETTP4643F; CAD_APPROVED: Yes; FPLIST: RC0402_25,RC0402_HD,0402_CC; Tolerance: 1%; ROHS: Yes; HEIGHT: 0.40 MM; PCB Footprint: 0402_CC
R144 R177 = RES_Dup1: RES MF ZERO OHM 1/16W 5% 0402; CLASS: DISCRETE; FPLIST: RC0402_25,RC0402_HD,RC0402_X2,0402_CC; CAD_APPROVED: Yes; MFG_PN01: MCR01MZPJ000; MFG_NAME01: ROHM; AGILE_PN: 470-75394; ROHS: Yes; Tolerance: 5%; HEIGHT: 0.45 MM; PCB Footprint: 0402_CC
R148 R178 R207 R221 = RES_Dup1: RES MF ZERO OHM 1/16W 5% 0402; CLASS: DISCRETE; AGILE_PN: 470-75394; MFG_NAME01: ROHM; MFG_PN01: MCR01MZPJ000; CAD_APPROVED: Yes; FPLIST: RC0402_25,RC0402_HD,RC0402_X2,0402_CC; HEIGHT: 0.45 MM; Tolerance: 5%; ROHS: Yes; PCB Footprint: 0402_CC
R153 = RES_Dup1: RES MF 15K  1/16W 1% 0402; CLASS: DISCRETE; AGILE_PN: 470-30965; MFG_NAME01: WALSIN TECHNOLOGY CORP.; MFG_PN01: WR04X1502FTL; CAD_APPROVED: Yes; FPLIST: RC0402_25,RC0402_HD,0402_CC; SIGNAL_MODEL: DEFAULT_RESISTOR_15000OHM_2_1; HEIGHT: 0.40 MM; TOL: 1%; Tolerance: 1%; ROHS: Yes; PCB Footprint: 0402_CC
R155 R211 = RES_Dup1: RES MF 1.0K 1/16W 5% 0402; CLASS: DISCRETE; AGILE_PN: 470-75555; MFG_NAME01: VISHAY INTERTECHNOLOGY; MFG_PN01: CRCW04021K00JNED; CAD_APPROVED: Yes; FPLIST: RC0402_25,RC0402_HD,RC0402_X2,0402_CC; Tolerance: 5%; ROHS: Yes; HEIGHT: 0.41mm; PCB Footprint: 0402_CC
R156 R237 = RES_Dup1: RES MF 10K 1/16W 5% 0402; CLASS: DISCRETE; AGILE_PN: 470-75557; MFG_NAME01: VISHAY INTERTECHNOLOGY; MFG_PN01: CRCW040210K0JNED; CAD_APPROVED: Yes; FPLIST: RC0402_25,RC0402_HD,0402_CC; HEIGHT: 0.4 MM; Tolerance: 5%; ROHS: Yes; PCB Footprint: 0402_CC
  R156: TOL: 5%
R157 = RES_Dup1: RES MF 100K 1/16W 1% 0402; CLASS: DISCRETE; FPLIST: RC0402_25,RC0402_HD,0402_CC; CAD_APPROVED: Yes; MFG_PN01: NRCL04F1003TRF; MFG_NAME01: NIC COMPONENTS CORP; AGILE_PN: 470-76240; HEIGHT: 0.4MM; ROHS: Yes; Tolerance: 1%; PCB Footprint: 0402_CC
R159 R172 = RES_Dup1: RES MF 270 OHM 1/16W 5% 0402; CLASS: DISCRETE; FPLIST: RC0402_25,RC0402_HD,0402_CC; CAD_APPROVED: Yes; Temp_Range: -55C to +155C; MFG_PN01: RC0402JR-07270RL; MFG_NAME01: Yageo; AGILE_PN: 470-81890; HEIGHT: 0.4MM; ROHS: Yes; Tolerance: 5%; PCB Footprint: 0402_CC
R161 R179 = RES_Dup1: RES MF 12.0K 1/16W 1% 0402; CLASS: DISCRETE; AGILE_PN: 470-76083; MFG_NAME01: BOURNS; MFG_PN01: CR0402-FX-1202GLF; CAD_APPROVED: Yes; FPLIST: RC0402_25,RC0402_HD,0402_CC; Tolerance: 1%; ROHS: Yes; HEIGHT: 0.4 MM; PCB Footprint: 0402_CC
R164 R181 R190 = RES_Dup1: RES MF 2.2K 1/16W 5% 0402; CLASS: DISCRETE; FPLIST: RC0402_25,RC0402_HD,0402_CC; CAD_APPROVED: Yes; MFG_PN01: RC0402JR-072K2L; MFG_NAME01: YAGEO AMERICA; AGILE_PN: 470-76602; TOL: 5%; ROHS: Yes; Tolerance: 5%; HEIGHT: 0.4 MM; PCB Footprint: 0402_CC
R166 = RES_Dup1: RES MF 100K 1/16W 5% 0402; CLASS: DISCRETE; Temp_Range: -55C to +155C; AGILE_PN: 470-75597; MFG_NAME01: VENKEL COMPANY; MFG_PN01: CR0402-16W-104JT; CAD_APPROVED: Yes; FPLIST: RC0402_25,RC0402_HD,0402_CC; ROHS: Yes; TOL: 5%; HEIGHT: 0.40 MM; PCB Footprint: 0402_CC
R170 R174 = RES_Dup1: RES MF 12.0K 1/16W 1% 0402; CLASS: DISCRETE; FPLIST: RC0402_25,RC0402_HD,0402_CC; CAD_APPROVED: Yes; MFG_PN01: CR0402-FX-1202GLF; MFG_NAME01: BOURNS; AGILE_PN: 470-76083; HEIGHT: 0.4 MM; ROHS: Yes; Tolerance: 1%; PCB Footprint: 0402_CC
R218 = RES_Dup1: RES MF 4.7K 1/16W 5% 0402; CLASS: DISCRETE; SIGNAL_MODEL: DEFAULT_RESISTOR_4700OHM_2_1; FPLIST: RC0402_25,RC0402_HD,0402_CC; CAD_APPROVED: Yes; MFG_PN01: NRCL04J472TRF; MFG_NAME01: NIC COMPONENTS CORP; AGILE_PN: 470-75626; HEIGHT: 0.41mm; TOL: 5%; ROHS: Yes; Tolerance: 5%; PCB Footprint: 0402_CC
R227 = RES_Dup1: RES MF 4.7K 1/16W 5% 0402; CLASS: DISCRETE; AGILE_PN: 470-75626; MFG_NAME01: NIC COMPONENTS CORP; MFG_PN01: NRCL04J472TRF; CAD_APPROVED: Yes; FPLIST: RC0402_25,RC0402_HD,0402_CC; SIGNAL_MODEL: DEFAULT_RESISTOR_4700OHM_2_1; Tolerance: 5%; ROHS: Yes; TOL: 5%; HEIGHT: 0.41mm; PCB Footprint: 0402_CC
R377 = RES_Dup1: RES MF 200K 1/10W 1% AEC-Q200 0402; CLASS: DISCRETE; AGILE_PN: 470-31093; MFG_NAME01: KOA SPEER; MFG_PN01: RK73H1ETTP2003F; CAD_APPROVED: Yes; FPLIST: RC0402_25,RC0402_HD,0402_CC; Temp_Range: -55C to +155C; HEIGHT: 0.40 MM; ROHS: Yes; PCB Footprint: 0402_CC
R1867 = RES_Dup1: RES MF 100 OHM 1/16W 5% 0402; CLASS: DISCRETE; AGILE_PN: 470-82143; MFG_NAME01: YAGEO AMERICA; MFG_PN01: RC0402JR-07100RL; Temp_Range: -55¡ãC to +155¡ãC; CAD_APPROVED: Yes; FPLIST: RC0402_25,RC0402_HD,RC0402_X2,0402_CC; Tolerance: 5%; ROHS: Yes; HEIGHT: 0.45MM; PCB Footprint: 0402_CC
R1868 = RES_Dup1: RES MF 100 OHM 1/16W 5% 0402; CLASS: DISCRETE; FPLIST: RC0402_25,RC0402_HD,RC0402_X2,0402_CC; CAD_APPROVED: Yes; Temp_Range: -55¡ãC to +155¡ãC; MFG_PN01: RC0402JR-07100RL; MFG_NAME01: YAGEO AMERICA; AGILE_PN: 470-82143; HEIGHT: 0.45MM; ROHS: Yes; Tolerance: 5%; PCB Footprint: 0402_CC
SW9 = SW_PB_ESW: SW SPST MOM NO PB TACT 50mA 50V SMT; CLASS: IC; AGILE_PN: 510-77562; MFG_NAME01: E SWITCH; MFG_PN01: TL3301AF260QG/TR; CAD_APPROVED: Yes; ROHS: Yes; HEIGHT: 5MM; PCB Footprint: SW4_PB_ESW_SM_P177
TP25 TP26 = TestLoop: TEST POINT PAD 30MIL DIA SMT, NO PART TO ORDER; CLASS: IO; CAD_APPROVED: Yes; MFG_PN01: NOTACOMPONENT; AGILE_PN: 211-76642; HEIGHT: 0.1MM; ROHS: Yes; MFG_NAME01: NOTACOMPONENT; PCB Footprint: TPAD_030
U9 = PRTR5V0U2X: IC USB ESD PROTECTION 8KV SOT143; AGILE_PN: 315-76725; MFG_NAME01: NEXPERIA; Temp_Range: -40¡ã C to +85¡ã C; CAD_APPROVED: Yes; CLASS: IC; MFG_PN01: PRTR5V0U2X; ROHS: Yes; HEIGHT: 1.1MM; PCB Footprint: SOT143B
U17 = UM1750S-00_5P: IC VREG LDO ADJ 1-5V 350mA 2.5-6V SOT23-5; CAD_APPROVED: Yes; MFG_NAME01: Union Semiconductor, Inc; AGILE_PN: 315-80554; CLASS: IC; HEIGHT: 1.25MM; ROHS: Yes; MFG_PN01: UM1750S-00; PCB Footprint: sot23-5_a
U22 = NX5P3090UK_WLCSP12: IC USB PD TYPE C CURRENT LIMITED PWR SW 2.5-5.5V WLCSP12; AGILE_PN: 312-81574; MFG_NAME01: NXP SEMICONDUCTORS; MFG_PN01: NX5P3090UK,012; CAD_APPROVED: Yes; CLASS: IC; ROHS: Yes; HEIGHT: 0.565 MM; PCB Footprint: wlcsp12_0p4_1p38x1p68mm_smdp
U24 = LPC432_BGA_100P: IC MCU  CORTEX M4 CORE 512kB FLASH 2.4-3.6V BGA100; SWAP_INFO: (S1+S2); SPLIT_INST: TRUE; AGILE_PN: 344-02176; MFG_NAME01: NXP SEMICONDUCTORS; MFG_PN01: LPC4322JET100E; CAD_APPROVED: Yes; CLASS: IC; ROHS: Yes; HEIGHT: 1.2MM; PCB Footprint: fbga100_0p8_9x9
U29 = NTSX2102GU8H_8P: IC DUAL SUPPLY XCVR 50 MBPS 5.5V XQFN8; CAD_APPROVED: Yes; MFG_NAME01: NXP SEMICONDUCTORS; AGILE_PN: 312-80763; PCB Footprint: xqfn8_1p45x1p25mm; CLASS: IC; HEIGHT: 0.5MM; ROHS: Yes; MFG_PN01: NTSX2102GU8H; VOLTAGE: 5.5V
U31 = NTB0102_8P: IC XCVR 2-BIT 1.65-3.6V/2.3-5.5V TSSOP8; CAD_APPROVED: Yes; MFG_PN01: NTS0102DP; MFG_NAME01: NXP SEMICONDUCTORS; AGILE_PN: 312-80889; CLASS: IC; HEIGHT: 1.1MM; ROHS: Yes; PCB Footprint: tssop8_a
U44 U46 = 74LVCH1T45_6P: IC XCVR XLATING DUAL 3-STATE 1.2- 5.5V TSSOP6; AGILE_PN: 312-81277; MFG_NAME01: NEXPERIA; CAD_APPROVED: Yes; CLASS: IC; MFG_PN01: 74LVC1T45GW,125; ROHS: Yes; HEIGHT: 1.1MM; PCB Footprint: SOT-363_0P65_SMT
U45 = 74LVC2T45DC_8P: IC TRANSLATING XCVR DUAL BIT/SUPPLY TS 1.2-5.5V VSSOP8; AGILE_PN: 312-81751; MFG_NAME01: NEXPERIA; Temp_Range: -40¡ãC to +125¡ãC; CAD_APPROVED: Yes; CLASS: IC; MFG_PN01: 74LVC2T45DC; ROHS: Yes; HEIGHT: 1MM; PCB Footprint: SSOP8_DCU
Y3 = XTAL: XTAL 12MHZ RSN -- 18PF 30PPM SMT; CLASS: IC; CAD_APPROVED: Yes; MFG_PN01: ABLS2-12.000MHZ-D4Y-T; MFG_NAME01: ABRACON CORP; AGILE_PN: 230-78082; HEIGHT: 3.3MM; ROHS: Yes; PCB Footprint: xtl2_11p6x4p85_sm